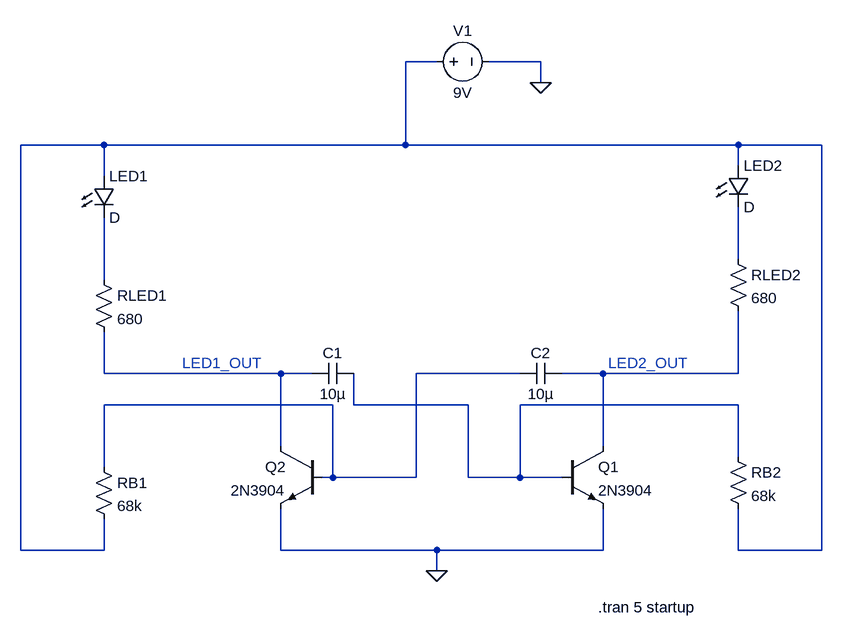
[diagram p0: schematic Astable_Multivibrator.asc]
Astable_Multivibrator.asc, the LTspice schematic file:
Version 4.1
SHEET 1 1156 680
WIRE 560 -256 512 -256
WIRE 720 -256 640 -256
WIRE 720 -224 720 -256
WIRE 48 -128 -80 -128
WIRE 512 -128 512 -256
WIRE 512 -128 48 -128
WIRE 1024 -128 512 -128
WIRE 1152 -128 1024 -128
WIRE 1024 -96 1024 -128
WIRE 48 -80 48 -128
WIRE 1024 48 1024 -32
WIRE 48 80 48 -16
WIRE 48 224 48 160
WIRE 320 224 48 224
WIRE 368 224 320 224
WIRE 688 224 528 224
WIRE 816 224 752 224
WIRE 1024 224 1024 128
WIRE 1024 224 816 224
WIRE 400 272 48 272
WIRE 432 272 432 224
WIRE 608 272 432 272
WIRE 1024 272 688 272
WIRE 320 336 320 224
WIRE 816 336 816 224
WIRE 1024 352 1024 272
WIRE 48 368 48 272
WIRE 400 384 400 272
WIRE 400 384 384 384
WIRE 528 384 528 224
WIRE 528 384 400 384
WIRE 608 384 608 272
WIRE 688 384 688 272
WIRE 688 384 608 384
WIRE 752 384 688 384
WIRE -80 496 -80 -128
WIRE 48 496 48 448
WIRE 48 496 -80 496
WIRE 320 496 320 432
WIRE 560 496 320 496
WIRE 816 496 816 432
WIRE 816 496 560 496
WIRE 1024 496 1024 432
WIRE 1152 496 1152 -128
WIRE 1152 496 1024 496
WIRE 560 528 560 496
FLAG 560 528 0
FLAG 720 -224 0
SYMBOL res 32 64 R0
SYMATTR InstName RLED1
SYMATTR Value 680
SYMBOL res 32 352 R0
SYMATTR InstName RB1
SYMATTR Value 68k
SYMBOL res 1008 32 R0
SYMATTR InstName RLED2
SYMATTR Value 680
SYMBOL res 1008 336 R0
SYMATTR InstName RB2
SYMATTR Value 68k
SYMBOL LED 1008 -96 R0
SYMATTR InstName LED2
SYMBOL LED 32 -80 R0
SYMATTR InstName LED1
SYMBOL cap 432 208 R90
WINDOW 0 0 32 VBottom 2
WINDOW 3 32 32 VTop 2
SYMATTR InstName C1
SYMATTR Value 10µ
SYMBOL cap 752 208 R90
WINDOW 0 0 32 VBottom 2
WINDOW 3 32 32 VTop 2
SYMATTR InstName C2
SYMATTR Value 10µ
SYMBOL npn 752 336 R0
SYMATTR InstName Q1
SYMATTR Value 2N3904
SYMBOL npn 384 336 M0
SYMATTR InstName Q2
SYMATTR Value 2N3904
SYMBOL voltage 544 -256 R270
WINDOW 0 32 56 VTop 2
WINDOW 3 -32 56 VBottom 2
SYMATTR InstName V1
SYMATTR Value 9V
TEXT 168 208 Left 2 ;LED1_OUT
TEXT 824 208 Left 2 ;LED2_OUT
TEXT 808 584 Left 2 !.tran 5 startup

The netlist it stands for:
* Astable_Multivibrator.asc
RLED1 N003 N004 680
RB1 N005 N001 68k
RLED2 N002 N006 680
RB2 N007 N001 68k
D§LED2 N001 N002 D
D§LED1 N001 N003 D
C1 N007 N004 10µ
C2 N006 N005 10µ
Q1 N006 N007 0 0 2N3904
Q2 N004 N005 0 0 2N3904
V1 N001 0 9V
.model D D
.lib standard.dio
.model NPN NPN
.model PNP PNP
.lib standard.bjt
* LED1_OUT
* LED2_OUT
.tran 5 startup
.backanno
.end